# EAGLE schematic controlBoard (EAGLE 9.2.2)
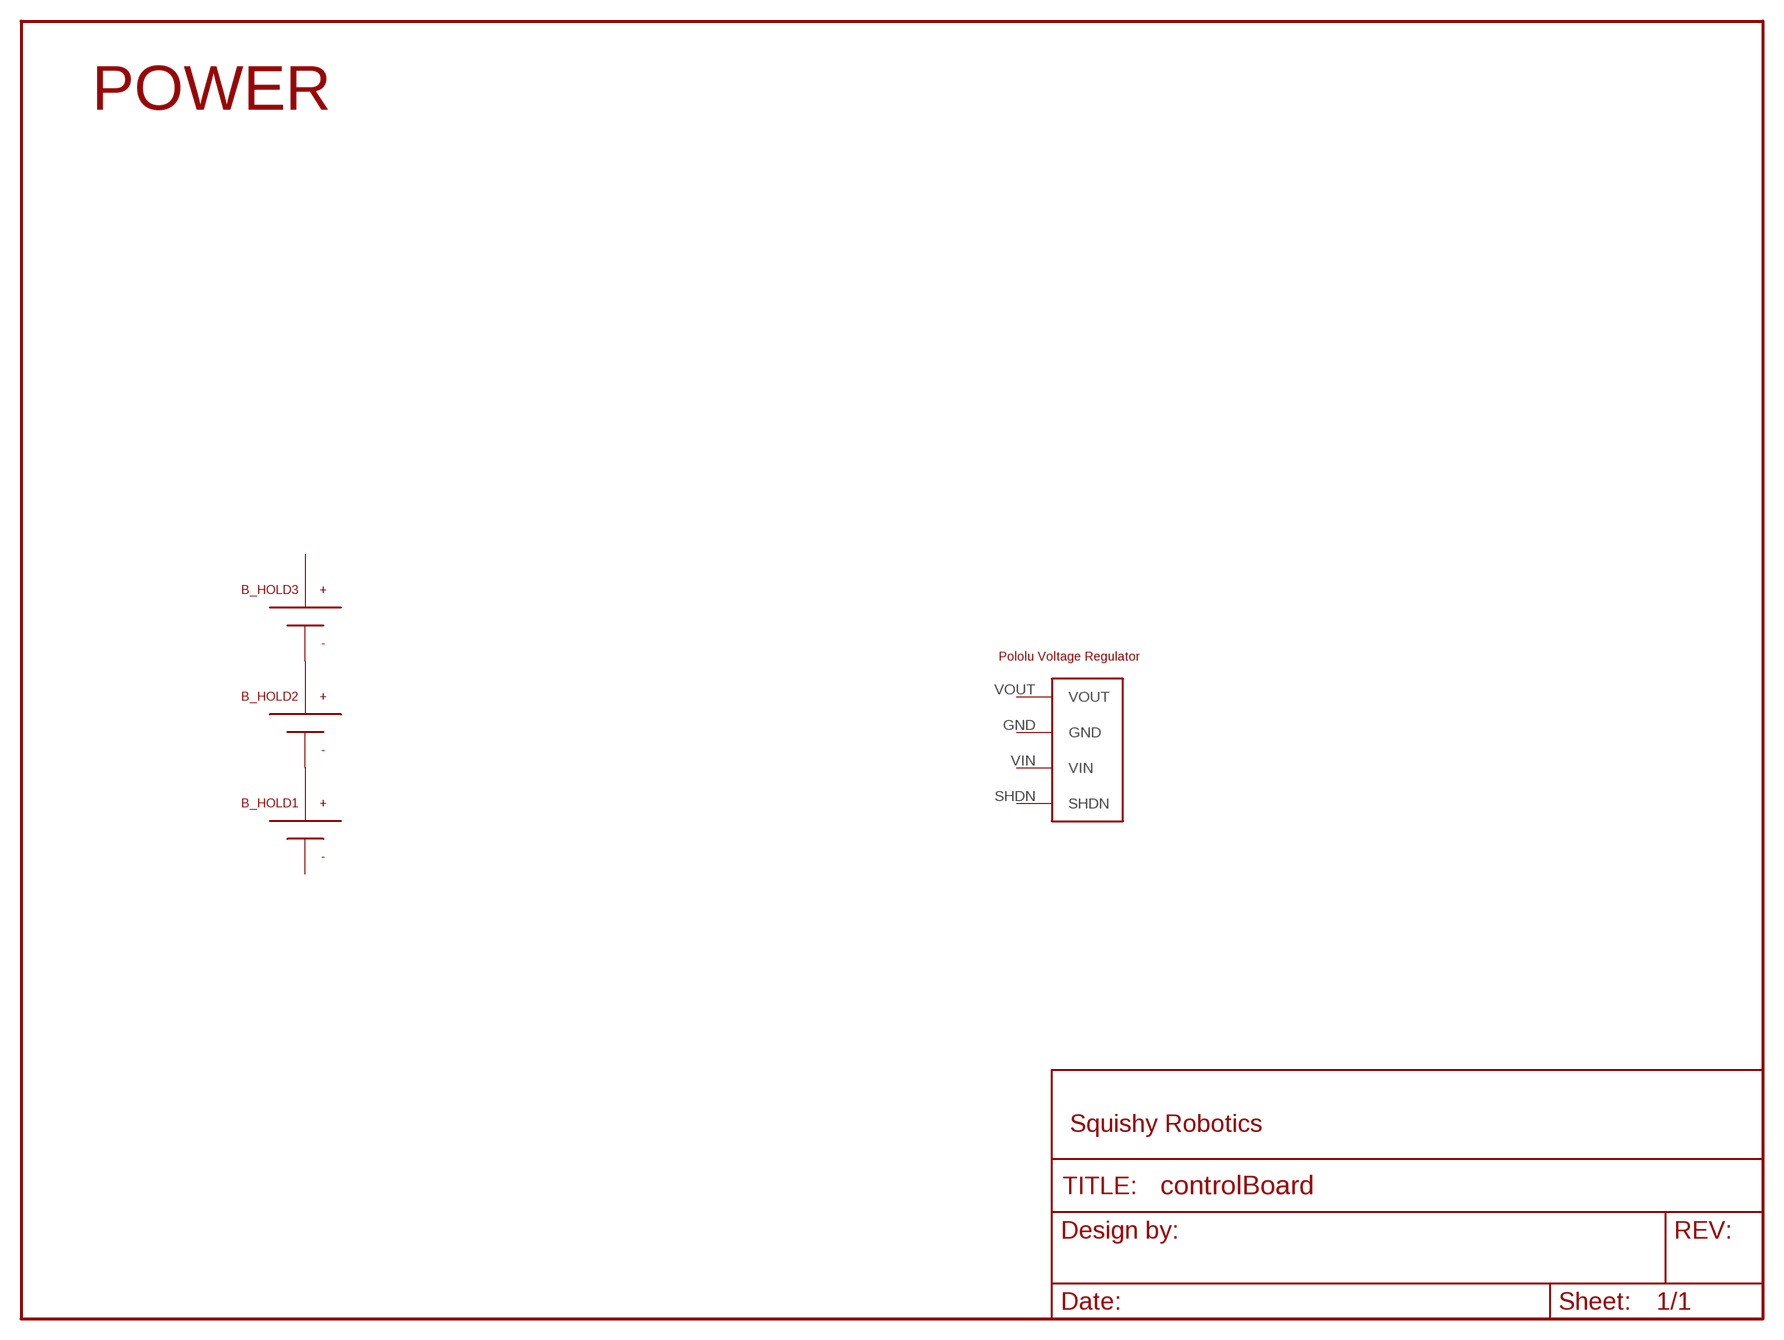
[diagram p0: schematic, sheet 1]

## Parts
B_HOLD1  BH-18650-PC-ND  [BH-18650-PC]
B_HOLD2  BH-18650-PC-ND  [BH-18650-PC]
B_HOLD3  BH-18650-PC-ND  [BH-18650-PC]
U$1  POLOLU_VOLTAGE_REGULATOR_D24V5F3  [POLOLU_VOLTAG_REGULATOR_D24V5F3]

## Nets
N$1: B_HOLD2.P$1(POS) B_HOLD3.P$2(NEG)
N$2: B_HOLD1.P$1(POS) B_HOLD2.P$2(NEG)
Unconnected: U$1.GND U$1.SHDN U$1.VIN U$1.VOUT

## Notes on the sheet
- POWER

## Power pins joined to a net without a drawn wire
NEG: B_HOLD1.P$2(NEG)
POS: B_HOLD3.P$1(POS)

## Library data of the parts
B_HOLD1-B_HOLD3 = BEST_Custom:BH-18650-PC-ND: Battery holder for a 18650 Lithiom ion battery. Found on DigiKey here. <https://www.digikey.com/product-detail/en/BH-18650-PC/BH-18650-PC-ND/3029216/?itemSeq=284347977>
U$1 = BEST_Custom:POLOLU_VOLTAGE_REGULATOR_D24V5F3